# Altium schematic sheet TP4059.SchDoc
size A4
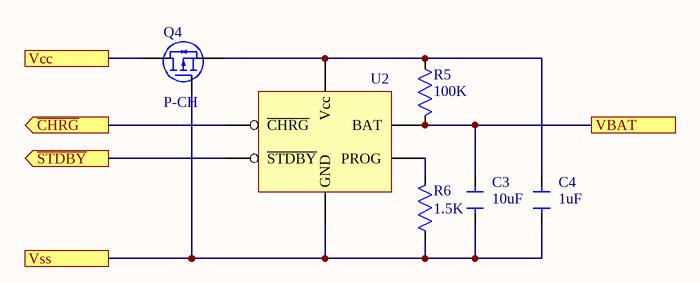
[diagram p0: TP4059.SchDoc]

## Parts
C3  value 10uF  [Cap_0603]  (hidden comment: Cap)
C4  value 1uF  [Cap_0603]  (hidden comment: Cap)
Q4  Polarity: P-CH  [SOT-23]  (hidden comment: SI2301DS-T1)
R5  value 100K  [RES_0402]  (hidden comment: Res)
R6  value 1.5K  [RES_0402]  (hidden comment: Res)
U2  TP4059  [SOT23-6]  (value not drawn)

## Ports
VBAT, Vcc, Vss, ~{CHRG} (out), ~{STDBY} (out)

## Nets
~{CHRG}: U2.2(~{CHRG}) ; port ~{CHRG}
~{STDBY}: U2.3(~{STDBY}) ; port ~{STDBY}
VBAT: C3.1 R5.1 U2.6(BAT) ; port VBAT
Vcc: Q4.1 ; port Vcc
Vss: C3.2 C4.2 Q4.2 R6.2 U2.4(GND) ; port Vss
NetC4_1: C4.1 Q4.3 R5.2 U2.1(Vcc)
NetR6_1: R6.1 U2.5(PROG)

## Library data of the parts
Q4 = SI2301DS-T1: Trans MOSFET P-CH 20V 2.3A 3-Pin TO-236 T/R; pin to pad: 1>2 2>1; Manufacturer: Vishay Siliconix; Rise Time: 36ns; Drain to Source Resistance: 130mR; Gate to Source Voltage (Vgs): 8V; Max Power Dissipation: 1.25W; Turn-Off Delay Time: 42ns; Turn-On Delay Time: 13ns; Number of Elements: 1; Element Configuration: Single; Drain to Source Voltage (Vdss): -20V; Supplier 1: Component Sense; Manufacturer Part Number: SI2301DS-T1; RoHS: No; Category: MOSFETs; Stock 1: 12531; Pricing 1: 143=0.17500, 500=0.15000, 1000=0.10000, 5000=0.09000, 10000=0.08000 (USD); Mount: Surface Mount; Case/Package: SOT-23-3; Number of Pins: 3; Weight: 0.050717oz; Min Operating Temperature: -55°C; Max Operating Temperature: 150°C; Packaging: Tape and Reel; Package Quantity: 3000; Continuous Drain Current (ID): 2.3A; Fall Time: 36ns; Power Dissipation: 1.25W; Number of Channels: 1; Length: 3.04mm; Height: 1.02mm; Width: 1.4mm; ComponentLink1URL: https://datasheet.ciiva.com/13048/70627-115154-13048148.pdf?src-supplier=Mouser; ComponentLink1Description: https://datasheet.ciiva.com/13048/70627-115154-13048148.pdf?src-supplier=Mouser; Supplier Part Number 1: SI2301DS-T1
U2 = TP4059: 600MA SOT23-6; pin to pad: 1>4 2>1 3>5 4>2 5>6 6>3; ComponentLink1Description: Datasheet; ComponentLink1URL: http://www.tp-asic.com/res/tp-asic/pdres/201403/TP4059.pdf